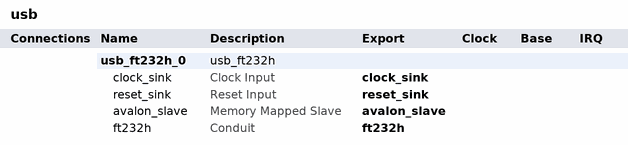
[diagram p0: system contents]
# Platform Designer (Qsys) system usb, Cyclone IV E EP4CE22E22C8
# Parameters at their usual value, and those the tool derives, are not listed.
package require qsys
create_system usb
set_project_property DEVICE_FAMILY {Cyclone IV E}
set_project_property DEVICE EP4CE22E22C8

add_instance usb_ft232h_0 usb_ft232h 1.5
set_instance_property usb_ft232h_0 AUTO_EXPORT true
set_instance_parameter_value usb_ft232h_0 AVALON_READ_LATENCY 1
set_instance_parameter_value usb_ft232h_0 AVALON_WRITE_LATENCY 1
set_instance_parameter_value usb_ft232h_0 FIFOS_DELAYPIPE 3
set_instance_parameter_value usb_ft232h_0 RX_FIFO_NUMWORDS 2048
set_instance_parameter_value usb_ft232h_0 RX_FIFO_WIDTHU 11
set_instance_parameter_value usb_ft232h_0 TX_FIFO_NUMWORDS 2048
set_instance_parameter_value usb_ft232h_0 TX_FIFO_WIDTHU 11
set_instance_parameter_value usb_ft232h_0 USB_READ_LATENCY 1
set_instance_parameter_value usb_ft232h_0 USB_WRITE_LATENCY 1

# exported interfaces
add_interface avalon_slave avalon slave
set_interface_property avalon_slave EXPORT_OF usb_ft232h_0.avalon_slave
add_interface clock_sink clock sink
set_interface_property clock_sink EXPORT_OF usb_ft232h_0.clock_sink
add_interface ft232h conduit end
set_interface_property ft232h EXPORT_OF usb_ft232h_0.ft232h
add_interface reset_sink reset sink
set_interface_property reset_sink EXPORT_OF usb_ft232h_0.reset_sink

set_interconnect_requirement {$system} qsys_mm.clockCrossingAdapter HANDSHAKE
set_interconnect_requirement {$system} qsys_mm.enableEccProtection FALSE
set_interconnect_requirement {$system} qsys_mm.insertDefaultSlave FALSE
set_interconnect_requirement {$system} qsys_mm.maxAdditionalLatency 1

save_system usb.qsys
